# EAGLE design circuit (EAGLE 6.5.0)
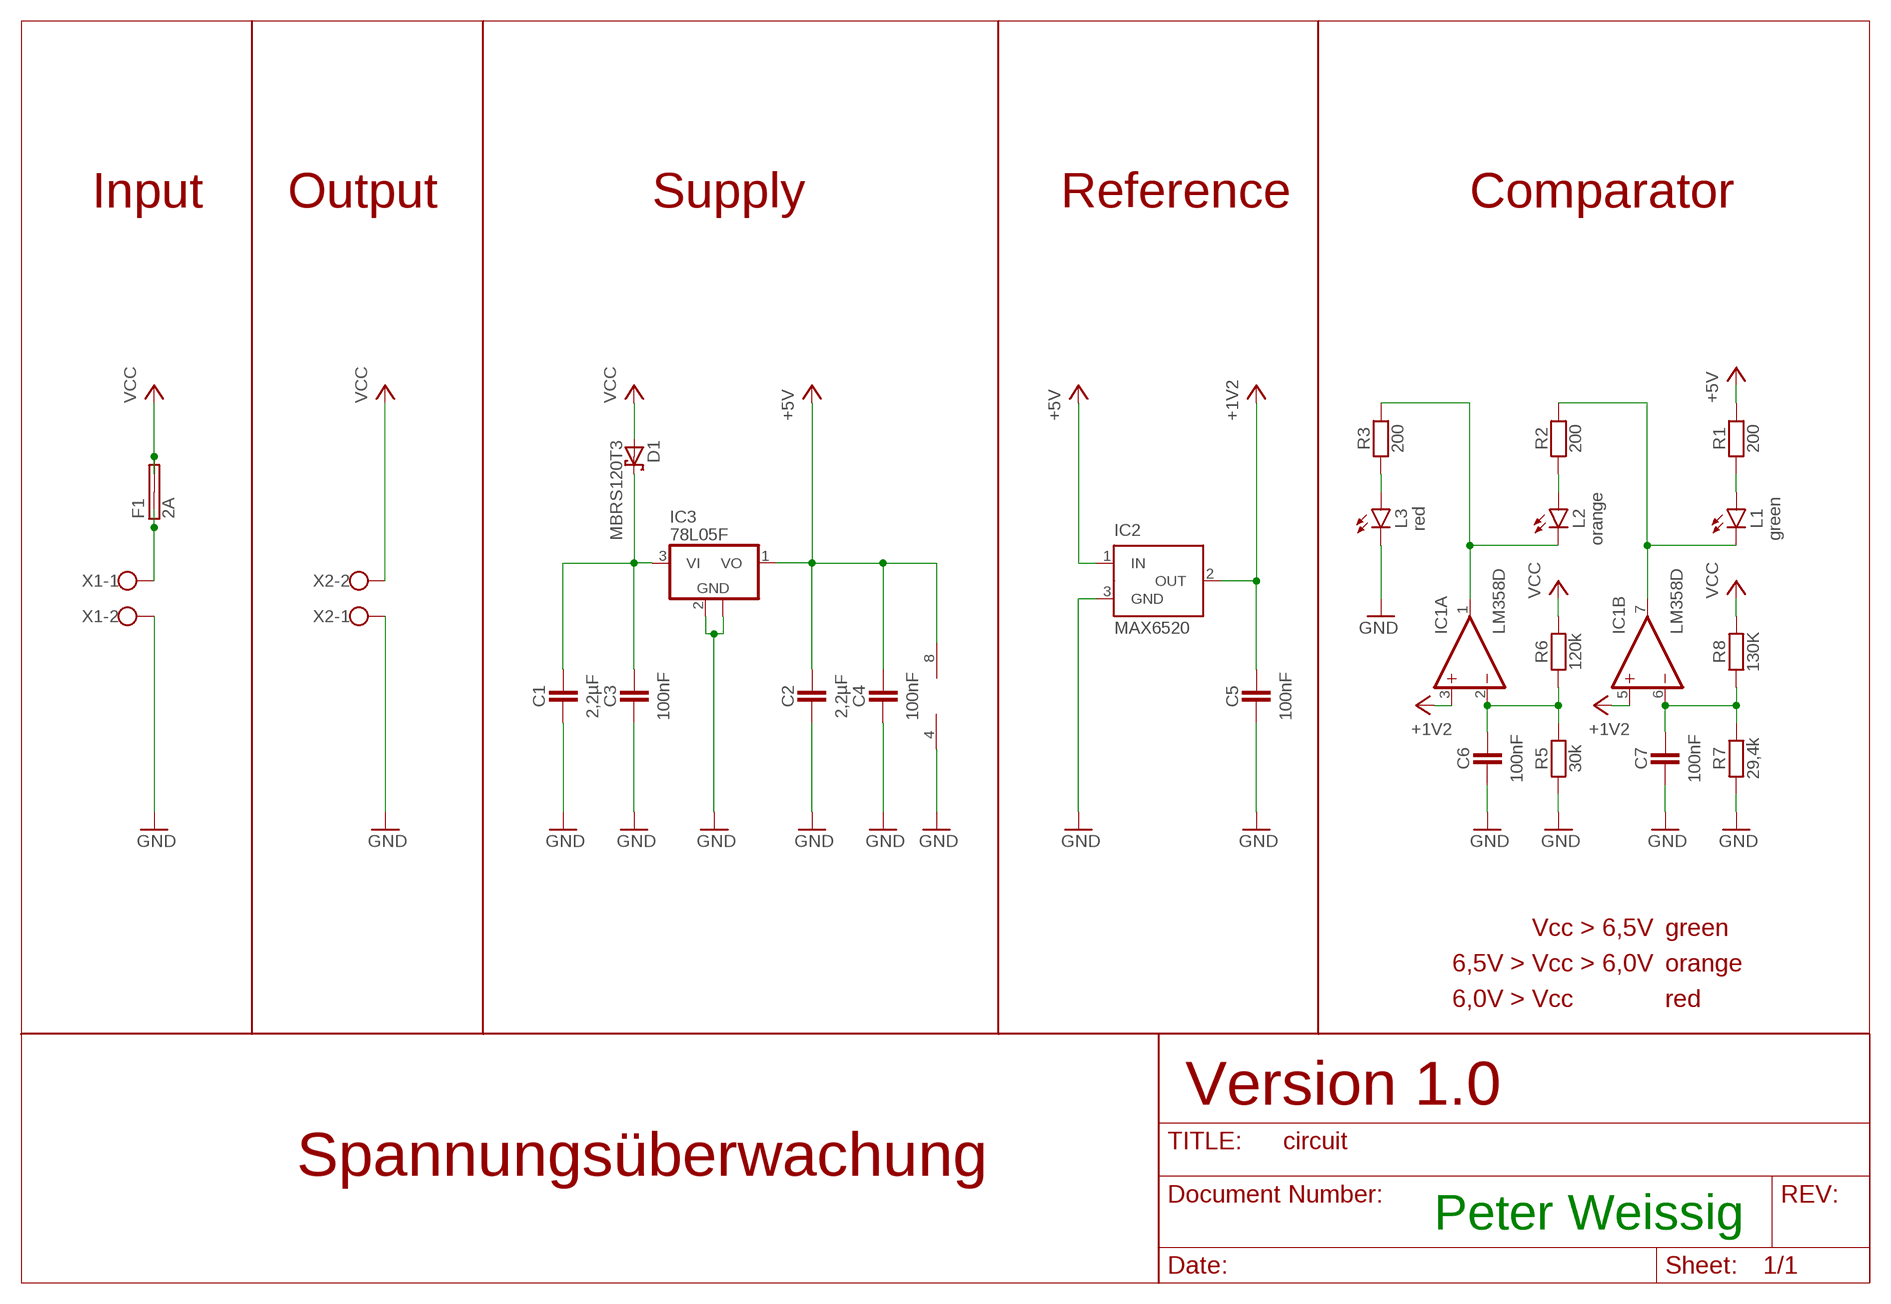
[diagram p0: schematic, sheet 1]

## Parts
C1  2,2µF  CAPACITATOR-1206  [SMD_1206]
C2  2,2µF  CAPACITATOR-1206  [SMD_1206]
C3  100nF  CAPACITATOR-1206  [SMD_1206]
C4  100nF  CAPACITATOR-1206  [SMD_1206]
C5  100nF  CAPACITATOR-1206  [SMD_1206]
C6  100nF  CAPACITATOR-1206  [SMD_1206]
C7  100nF  CAPACITATOR-1206  [SMD_1206]
D1  MBRS120T3  MBRS130LT3  [SMB]
F1  2A  SHK20L  [SHK20L]
IC1  LM358D  [SO08]
IC2  MAX6520  [SOT23]
IC3  78L05F  [SOT89]
L1  green  LED-3MM  [LED_3MM]
L2  orange  LED-3MM  [LED_3MM]
L3  red  LED-3MM  [LED_3MM]
R1  200  RESISTOR-1206  [SMD_1206]
R2  200  RESISTOR-1206  [SMD_1206]
R3  200  RESISTOR-1206  [SMD_1206]
R5  30k  RESISTOR-1206  [SMD_1206]
R6  120k  RESISTOR-1206  [SMD_1206]
R7  29,4k  RESISTOR-1206  [SMD_1206]
R8  130K  RESISTOR-1206  [SMD_1206]
X1  W237-102  [W237-102]
X2  W237-102  [W237-102]

## Nets
+3V3: C5.1 IC1.3(A:+IN) IC1.5(B:+IN) IC2.2(OUT) ; supply symbol labelled +1V2
+5V: C2.1 C4.1 IC1.8(P:V+) IC2.1(IN) IC3.1(VO) R1.1
GND: C1.2 C2.2 C3.2 C4.2 C5.2 C6.2 C7.2 IC1.4(P:V-) IC2.3(GND) IC3.2(GND) IC3.2@1(GND) L3.K(C) R5.1 R7.1 X1.2 X2.1
N$1: C6.1 IC1.2(A:-IN) R5.2 R6.1
N$15: F1.1A F1.1B X1.1
N$16: C7.1 IC1.6(B:-IN) R7.2 R8.1
N$17: C1.1 C3.1 D1.C IC3.3(VI)
N$18: L1.A R1.2
N$19: IC1.7(B:OUT) L1.K(C) R2.1
N$20: L3.A R3.2
N$21: IC1.1(A:OUT) L2.K(C) R3.1
N$22: L2.A R2.2
VCC: D1.A F1.2A F1.2B R6.2 R8.2 X2.2

## Notes on the sheet
- Input | Output | Supply | Reference | Comparator
- Vcc > 6,5V | green
- 6,5V > Vcc > 6,0V | orange
- 6,0V > Vcc | red
- Version 1.0
- Spannungsüberwachung
- Peter Weissig

## Library data of the parts
C1-C7 = robo_ag:CAPACITATOR: Kondensator
D1 = diode:MBRS130LT3: Schottky Power Rectifier Source: http://www.onsemi.com/pub/Collateral/MBRS130LT3-D.PDF
F1 = fuse:SHK20L: FUSE HOLDER 5 x 20 mm, SH contact, SHH1 Schukat, E1073 Buerklin; OC_FARNELL: unknown; OC_NEWARK: unknown
IC1 = linear:LM358: OP AMP also LM158; LM258; LM2904 Source: http://cache.national.com/ds/LM/LM158.pdf
IC2 = maxim:MAX6520: 1.2V Voltage Reference 50ppm/°C, SOT23, 3-Terminal Source: Data sheet <http://datasheets.maxim-ic.com/en/ds/MAX6520.pdf>; MF: MAXIM; MPN: MAX6520EUR-T; OC_FARNELL: unknown; OC_NEWARK: 02J4586
IC3 = linear:78L*: POSITOIV-VOLTAGE REGULATORS Output up to 100 mA Source: http://focus.ti.com/lit/ds/symlink/ua78l05.pdf
L1-L3 = robo_ag:LED: Led
R1-R3 R5-R8 = robo_ag:RESISTOR: Widerstand
X1 X2 = con-wago-500:W237-102: WAGO SCREW CLAMP; MPN: 237-102; OC_FARNELL: unknown; OC_NEWARK: 70K9898

## Board
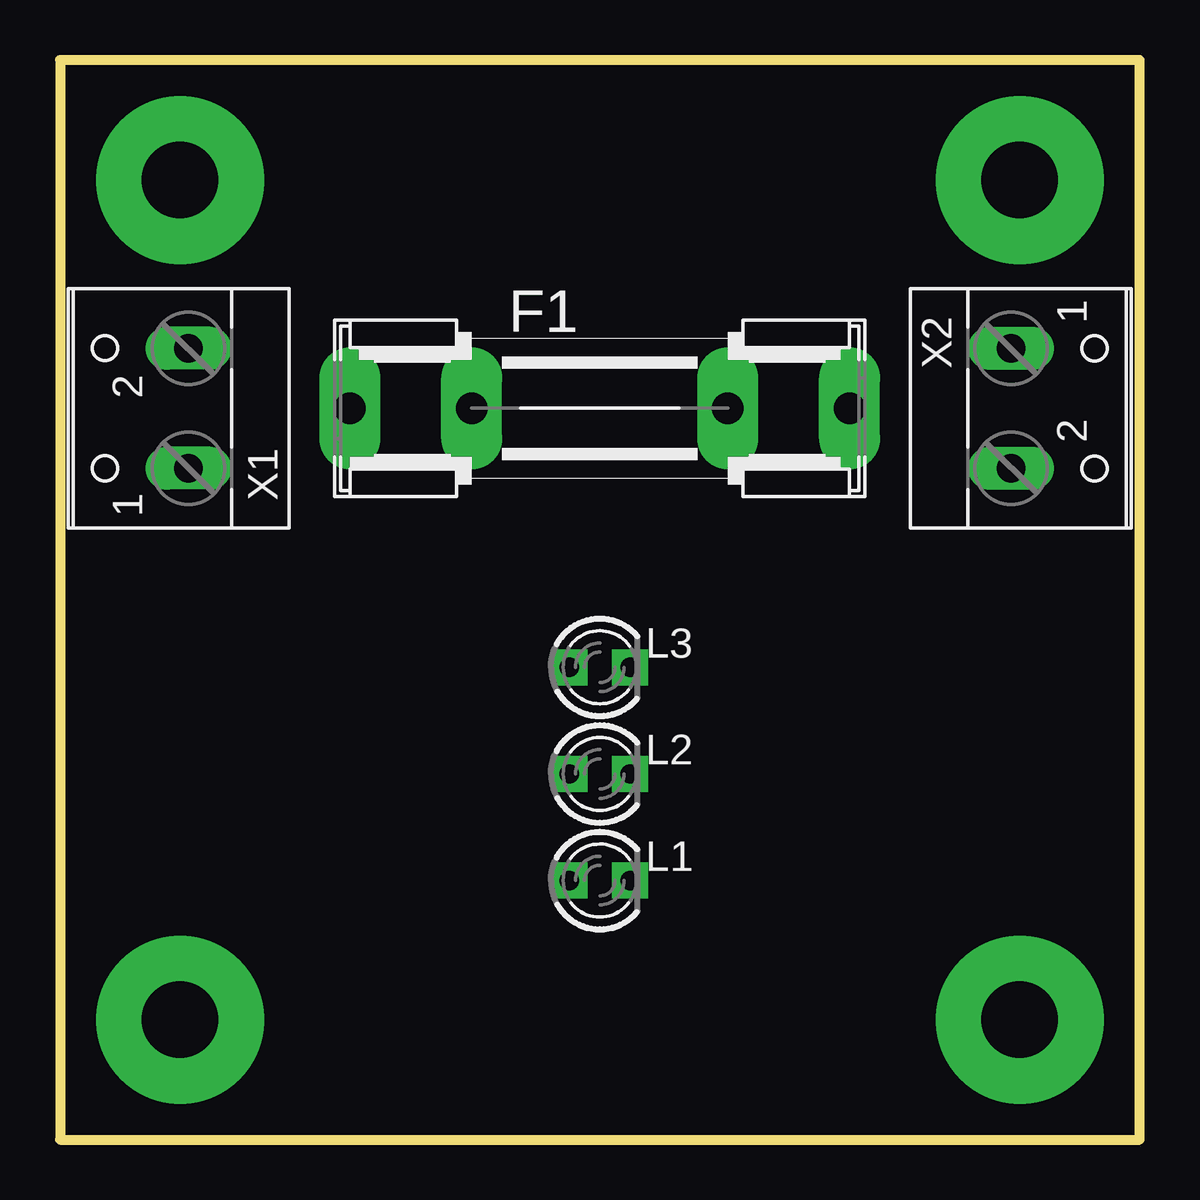
[diagram p1: board, top side]
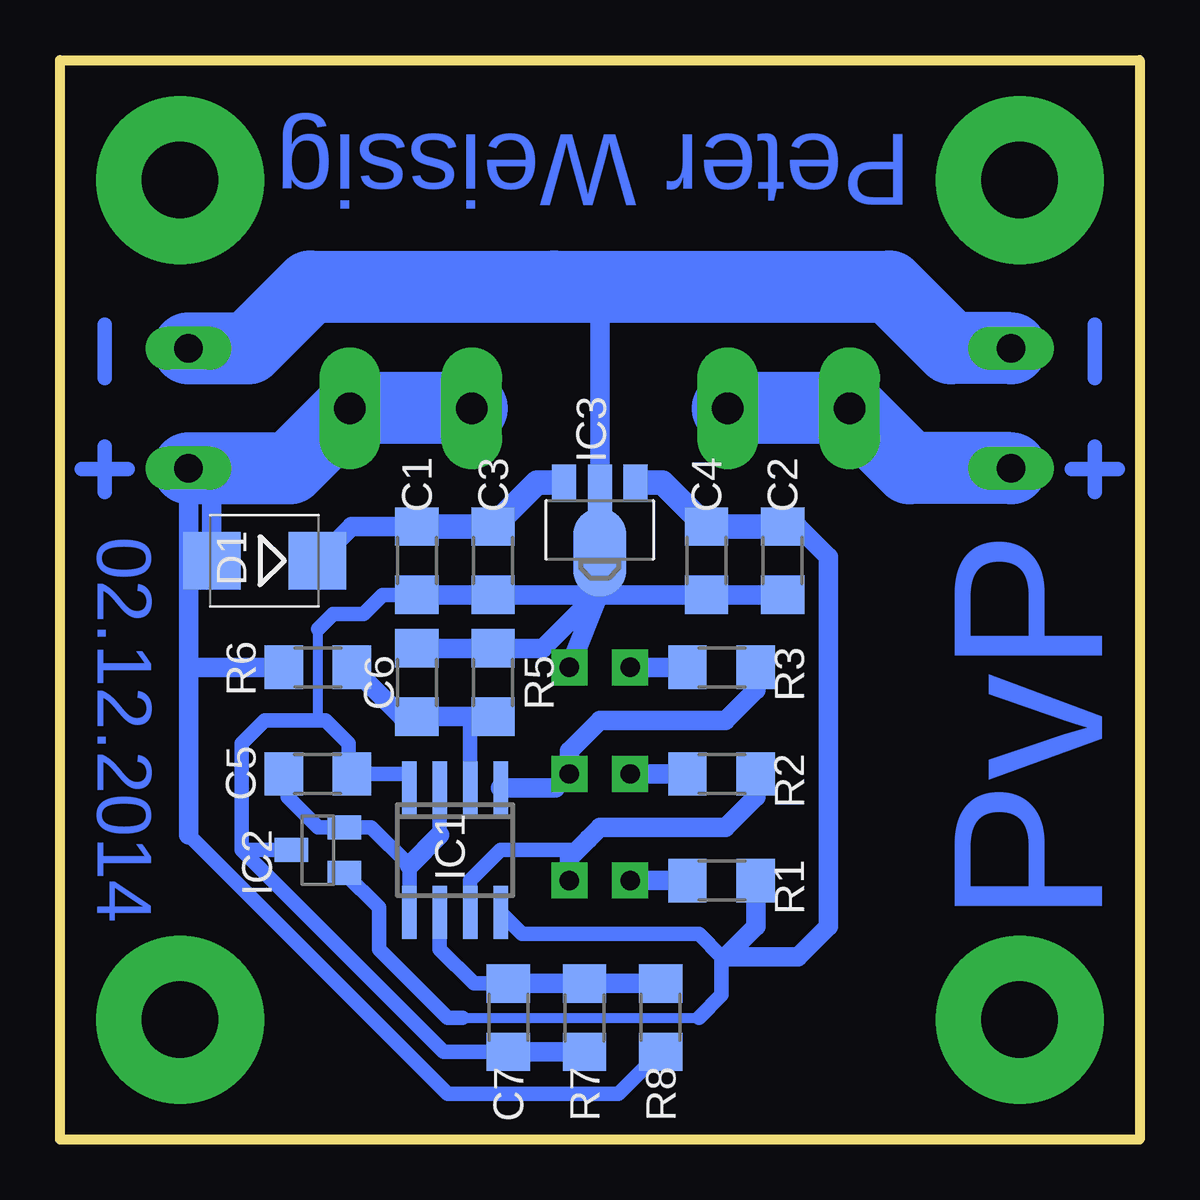
[diagram p2: board, bottom side, seen from below]

Size 45 x 45 mm. Coordinates in mm from the lower left corner, seen from the top.
Outline: 0,0 45,0 45,45 0,45 0,0
Copper layers (1*16): Top 0.035mm / dielectric 1.5mm / Bottom 0.035mm
Design rules "default": minimum track width 10mil, minimum drill 24mil, track to track 8mil, track to pad 8mil, pad to pad 8mil, via to via 8mil, smd to smd 8mil, copper to edge 40mil, drill to drill 8mil, minimum pad ring 10mil, minimum via ring 8mil, stop-mask expansion 4mil, vias tented up to drill 0mil, thermal gap 10mil

### Footprints (pad centres in the part's own frame; a part is rotated, then mirrored left to right if it is on the bottom)
SMD_1206 = smd 1.6 x 1.803: 1 -1.422,0; 2 1.422,0
SMB = smd 2.4 x 2.4: A 2.2,0; C -2.2,0
SHK20L = drill 1.321 pad 2.54 long: 1A -10.414,0; 1B -5.334,0; 2A 10.414,0; 2B 5.334,0
SO08 = smd 0.6 x 2.2: 1 -1.905,-2.6; 2 -0.635,-2.6; 3 0.635,-2.6; 4 1.905,-2.6; 5 1.905,2.6; 6 0.635,2.6; 7 -0.635,2.6; 8 -1.905,2.6
SOT23 = smd 1 x 1.4: 1 -0.95,-1.1; 2 0.95,-1.1; 3 0,1.1
SOT89 = smd 1 x 1.5: 1 -1.499,-1.981; 3 1.499,-1.981 | smd 1 x 2: 2 0,-1.727 | smd 2.2 x 3.7: 2@1 0,0.94
LED_3MM = drill 0.8 pad 1.5 square: A -1.27,0; K 1.27,0
W237-102 = drill 1.194 long: 1 -2.5,-1.27; 2 2.5,-1.27

### Placement (x,y rotation side)
C1  30.12,24.13 270 bottom
C2  14.88,24.13 270 bottom
C3  26.95,24.13 270 bottom
C4  18.05,24.13 270 bottom
C5  34.25,15.24 0 bottom
C6  30.12,19.05 90 bottom
C7  26.31,5.08 270 bottom
D1  36.47,24.13 180 bottom
F1  22.5,30.48 0 top
IC1  28.53,12.06 180 bottom
IC2  34.25,12.06 90 bottom
IC3  22.5,25.4 180 bottom
L1  22.5,10.79 0 top
L2  22.5,15.24 0 top
L3  22.5,19.68 0 top
R1  17.42,10.79 180 bottom
R2  17.42,15.24 180 bottom
R3  17.42,19.68 180 bottom
R5  26.95,19.05 270 bottom
R6  34.25,19.68 180 bottom
R7  23.14,5.08 90 bottom
R8  19.96,5.08 270 bottom
X1  4.08,30.48 90 top
X2  40.91,30.48 270 top

### Tracks (layer width: path | path; a pad name or v marks a point on that pad's centre or on a via)
+3V3
  Bottom 0.61: IC1.3 29.17,12.7 | IC1.5 30.44,11.43 32.02,13.02 IC2.2 34.24,13.02 35.52,14.29 35.52,15.24 C5.1
  Bottom 0.813: 29.17,12.7 30.44,11.43
+5V
  Bottom 0.406: 28.21,5.08 18.37,5.08
  Bottom 0.61: 17.42,7.62 17.27,7.62 | IC1.8 25.73,8.57 18.37,8.57 17.42,7.62 | 18.37,5.08 17.42,6.03 17.42,7.62 | 28.21,5.08 28.85,5.08 31.71,7.94 31.71,9.68 IC2.1
  Bottom 0.813: R1.1 16,8.89 17.27,7.62 14.24,7.62 12.97,8.89 12.97,24.28 14.24,25.55 C2.1
  Bottom 1.016: IC3.1 19.88,27.38 C4.1 C2.1
GND
  Bottom 0.406: 34.25,21.27 34.25,17.46 35.52,17.46
  Bottom 0.61: 34.25,21.27 33.61,21.91 32.34,21.91 31.54,22.71 C1.2 | 27.58,22.71 25.99,22.71 | C7.2 29.02,3.66 37.42,12.06 | IC1.4 30.44,15.24 C5.2 32.98,15.39 32.98,16.51 33.93,17.46 35.52,17.46 36.47,17.46 37.42,16.51 37.42,12.06 | IC2.3 37.42,12.06
  Bottom 0.813: 24.41,35.56 23.77,34.92 22.5,34.92 IC3.2 IC3.2@1 22.5,22.86 | C2.2 C4.2 22.5,22.71 | C1.2 C3.2 25.99,22.71 22.5,22.71 | 22.5,22.86 22.5,22.71 | C6.2 R5.1 24.89,20.47 22.5,22.86 | L3.K 22.5,22.86 | C7.2 R7.1
  Bottom 3: X1.2 7.86,32.98 10.44,35.56 24.41,35.56 34.56,35.56 37.15,32.98 X2.1
N$1
  Bottom 0.61: C6.1 30.75,17.63 | IC1.2 27.9,17.63 28.85,17.63
  Bottom 0.813: R6.1 32.81,19.68 30.75,17.63 | R5.2 28.85,17.63 C6.1
N$2  (via drill 3.2 pad 7)
  other vias: 5,5
N$3  (via drill 3.2 pad 7)
  other vias: 5,40
N$4  (via drill 3.2 pad 7)
  other vias: 40,5
N$5  (via drill 3.2 pad 7)
  other vias: 40,40
N$7
  Bottom 0.61: 42.19,27.94 44.09,27.94
N$8
  Bottom 0.61: 43.14,28.89 43.14,26.99
N$9
  Bottom 0.61: 43.14,31.75 43.14,33.97
N$10
  Bottom 0.61: 1.86,33.97 1.86,31.75
N$11
  Bottom 0.61: 0.91,27.94 2.81,27.94
N$12
  Bottom 0.61: 1.86,28.89 1.86,26.99
N$15
  Bottom 3: X1.1 9.59,27.98 F1.1A F1.1B
N$16
  Bottom 0.61: 25.36,6.5 27.73,6.5 29.17,7.94 IC1.6
  Bottom 0.813: R8.1 R7.2 25.36,6.5 C7.1
N$17
  Bottom 0.813: D1.C 32.85,25.55 C1.1
  Bottom 1.016: IC3.3 25.12,27.38 C3.1 C1.1
N$18
  Bottom 0.813: R1.2 L1.A
N$19
  Bottom 0.61: IC1.7 27.9,10.79 26.63,12.06 23.45,12.06 22.98,12.54
  Bottom 0.813: R2.1 16,14.29 17.27,13.02 22.5,13.02 22.98,12.54 23.77,11.75 L1.K
N$20
  Bottom 0.813: R3.2 L3.A
N$21
  Bottom 0.813: R3.1 16,18.73 17.27,17.46 22.5,17.46 23.77,16.19 L2.K 24.34,14.66 IC1.1
N$22
  Bottom 0.813: R2.2 L2.A
VCC
  Bottom 0.61: R8.2 21.71,1.91 28.85,1.91 39.65,12.7
  Bottom 0.813: X2.2 38.67,27 D1.A | 39.8,27.98 X2.2 | R6.2 39.65,19.68 | 39.65,19.68 X2.2 | 39.65,12.7 39.65,19.68
  Bottom 3: F1.2B F1.2A 35.41,27.98 X2.2

### Text on the board
Bottom: Peter Weissig | PvP | 02.12.2014